# EAGLE schematic t10_programmin_adapter2 (EAGLE 6.1)
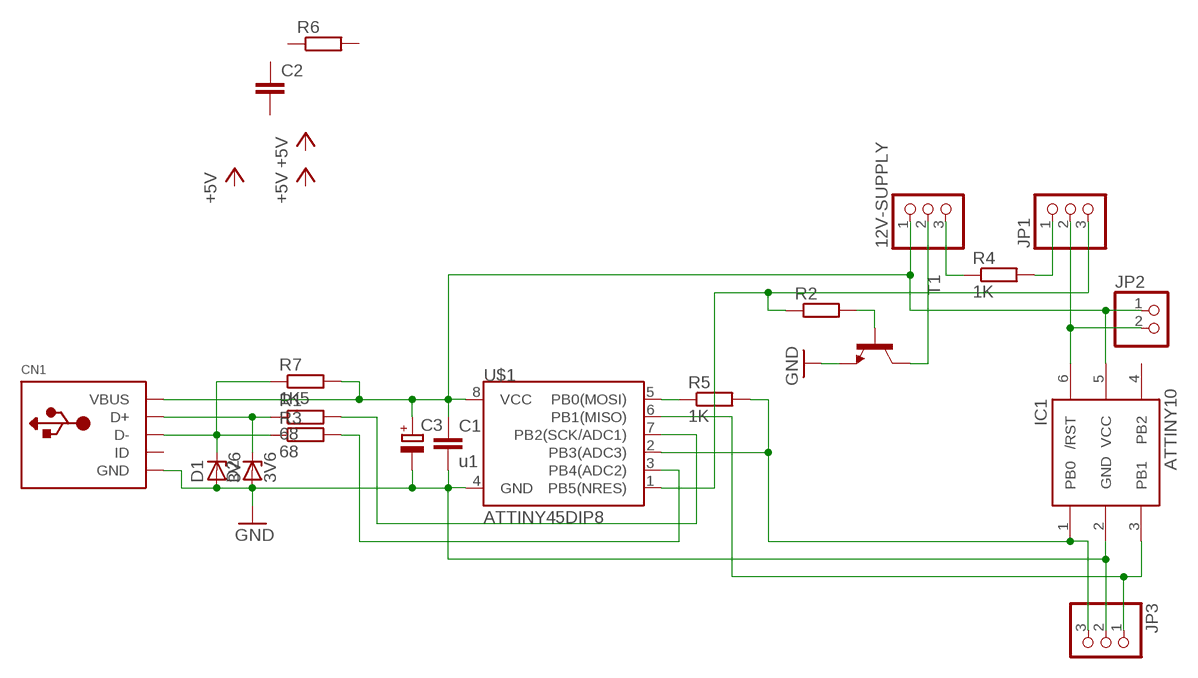
[diagram p0: schematic, sheet 1]

## Parts
12V-SUPPLY  PINHD-1X3/90  [1X03/90]
C1  u1  C-EU025-025X050  [C025-025X050]
C2  C-EU025-025X050  [C025-025X050]
C3  CPOL-EUE2.5-6  [E2,5-6]
CN1  USBTHM  [USB-MINIB-THM]
D1  3V6  ZENER-DIODEZD-7.5  [ZDIO-7.5]
D2  3V6  ZENER-DIODEZD-2.5  [ZDIO-2.5]
IC1  ATTINY10  [SOT23-6]
JP1  PINHD-1X3  [1X03]
JP2  PINHD-1X2  [1X02]
JP3  PINHD-1X3  [1X03]
R1  68  R-EU_0204/7  [0204/7]
R2  R-EU_0207/10  [0207/10]
R3  68  R-EU_0207/2V  [0207/2V]
R4  1K  R-EU_0207/2V  [0207/2V]
R5  1K  R-EU_0204/7  [0204/7]
R6  R-EU_0207/2V  [0207/2V]
R7  1K5  R-EU_0207/2V  [0207/2V]
T1  -NPN-TO92-EBC  [TO92-EBC]
U$1  ATTINY45DIP8  [DIP08]

## Nets
12V-SWITCH: JP1.3 R2.1 U$1.1(PB5(NRES))
GND: C1.2 C3.- CN1.GND D1.A D2.A IC1.2(GND) JP3.2 T1.E U$1.4(GND)
N$1: 12V-SUPPLY.1 C1.1 C3.+ CN1.VBUS IC1.5(VCC) JP2.1 R7.2 U$1.8(VCC)
N$2: 12V-SUPPLY.2 T1.C
N$3: IC1.6(/RST) JP1.2 JP2.2
N$4: CN1.D- D1.C R3.1 R7.1
N$5: CN1.D+ D2.C R1.1
N$6: R2.2 T1.B
N$7: R1.2 U$1.7(PB2(SCK/ADC1))
N$8: R3.2 U$1.3(PB4(ADC2))
N$9: JP1.1 R4.2
N$10: 12V-SUPPLY.3 R4.1
N$11: R5.1 U$1.5(PB0(MOSI))
N$12: IC1.1(PB0) JP3.3 R5.2 U$1.2(PB3(ADC3))
N$13: IC1.3(PB1) JP3.1 U$1.6(PB1(MISO))
Unconnected: C2.1 C2.2 CN1.ID IC1.4(PB2) R6.1 R6.2

## Library data of the parts
12V-SUPPLY JP1 JP3 = pinhead:PINHD-1X3: PIN HEADER
C1 C2 = rcl:C-EU: CAPACITOR, European symbol
C3 = rcl:CPOL-EU: POLARIZED CAPACITOR, European symbol
CN1 = adafruit_t10:USB: USB Connectors USBMINIB - Surface Mount Female Mini-B USB Connector 4UConnector: 06564 By microbuilder.eu Thru-hole RA Female Mini-B USB Connector 4UConnector: 18732 By ladyada.net
D1 D2 = diode:ZENER-DIODE: Z-Diode
IC1 = adafruit:ATTINY10: ATtiny4/5/9/10 8-bit Microcontroller with 512/1024 Bytes In-System Programmable Flash
JP2 = pinhead:PINHD-1X2: PIN HEADER
R1-R7 = rcl:R-EU_: RESISTOR, European symbol
T1 = transistor:*-NPN-: NPN Transistror BF959 corrected 2008.03.06
U$1 = SparkFun:ATTINY45: Atmel ATTiny45